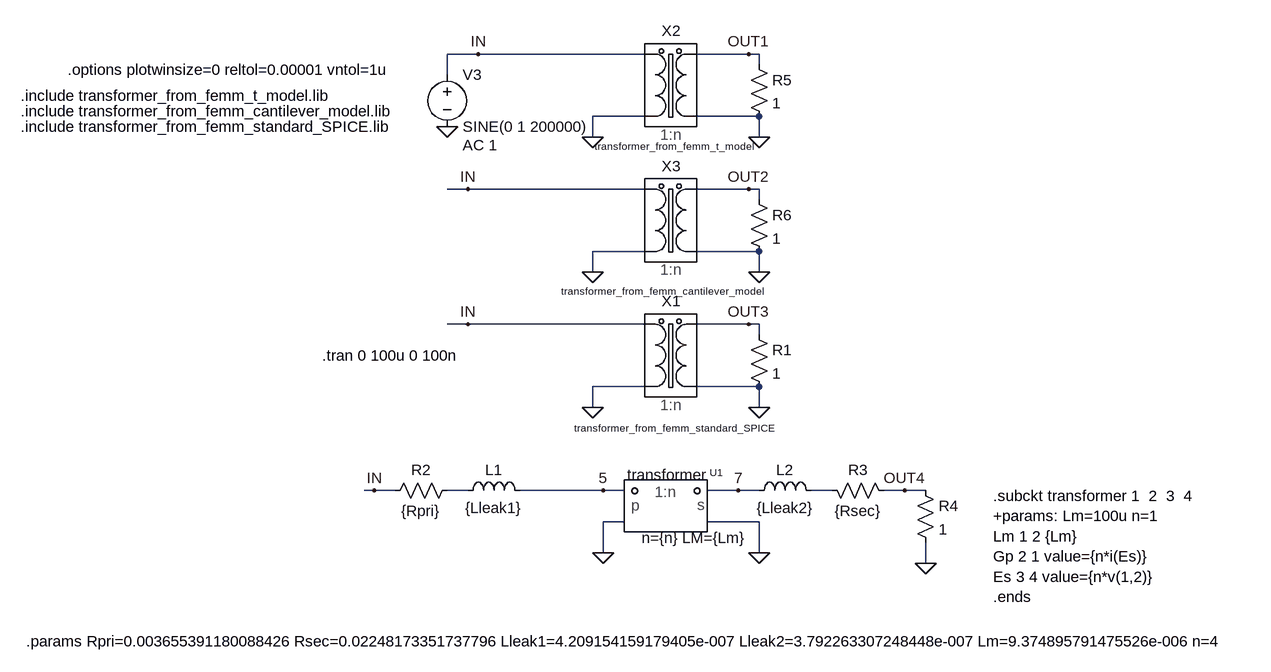
[diagram p0: schematic transformer_test.asc]
transformer_test.asc, the LTspice schematic file:
Version 4
SHEET 1 2508 680
WIRE -32 -256 -80 -256
WIRE 224 -256 -32 -256
WIRE 384 -256 304 -256
WIRE 400 -256 384 -256
WIRE 400 -240 400 -256
WIRE -80 -224 -80 -256
WIRE 224 -160 144 -160
WIRE 400 -160 304 -160
WIRE 144 -128 144 -160
WIRE 400 -128 400 -160
WIRE -48 -48 -80 -48
WIRE 224 -48 -48 -48
WIRE 384 -48 304 -48
WIRE 400 -48 384 -48
WIRE 400 -32 400 -48
WIRE 224 48 144 48
WIRE 400 48 304 48
WIRE 144 80 144 48
WIRE 400 80 400 48
WIRE -48 160 -80 160
WIRE 224 160 -48 160
WIRE 384 160 304 160
WIRE 400 160 384 160
WIRE 400 176 400 160
WIRE 224 256 144 256
WIRE 400 256 304 256
WIRE 144 288 144 256
WIRE 400 288 400 256
WIRE -192 416 -208 416
WIRE -160 416 -192 416
WIRE -48 416 -80 416
WIRE 160 416 32 416
WIRE 192 416 160 416
WIRE 368 416 320 416
WIRE 400 416 368 416
WIRE 512 416 480 416
WIRE 624 416 592 416
WIRE 656 416 624 416
WIRE 192 464 160 464
WIRE 400 464 320 464
WIRE 160 512 160 464
WIRE 400 512 400 464
WIRE 656 528 656 496
FLAG 160 416 5
FLAG 368 416 7
FLAG 160 512 0
FLAG 400 512 0
FLAG 656 528 0
FLAG -80 -144 0
FLAG 144 -128 0
FLAG 400 -128 0
FLAG -32 -256 IN
FLAG 384 -256 OUT1
FLAG -192 416 IN
FLAG 624 416 OUT4
FLAG 144 80 0
FLAG 400 80 0
FLAG 384 -48 OUT2
FLAG -48 -48 IN
FLAG 144 288 0
FLAG 400 288 0
FLAG 384 160 OUT3
FLAG -48 160 IN
SYMBOL res -64 400 R90
WINDOW 0 0 56 VBottom 2
WINDOW 3 32 56 VTop 2
SYMATTR InstName R2
SYMATTR Value {Rpri}
SYMBOL ind -64 432 R270
WINDOW 0 32 56 VTop 2
WINDOW 3 5 56 VBottom 2
SYMATTR InstName L1
SYMATTR Value {Lleak1}
SYMBOL res 496 400 M90
WINDOW 0 0 56 VBottom 2
WINDOW 3 32 56 VTop 2
SYMATTR InstName R3
SYMATTR Value {Rsec}
SYMBOL ind 496 432 M270
WINDOW 0 32 56 VTop 2
WINDOW 3 5 56 VBottom 2
SYMATTR InstName L2
SYMATTR Value {Lleak2}
SYMBOL transformer 256 448 R0
SYMATTR SpiceLine n={n} LM={Lm}
SYMATTR InstName U1
SYMBOL res 640 400 R0
SYMATTR InstName R4
SYMATTR Value 1
SYMBOL voltage -80 -240 R0
WINDOW 123 24 124 Left 2
WINDOW 39 0 0 Left 0
SYMATTR Value2 AC 1
SYMATTR InstName V3
SYMATTR Value SINE(0 1 200000)
SYMBOL res 384 -256 R0
SYMATTR InstName R5
SYMATTR Value 1
SYMBOL transformer_from_femm1 240 -208 R0
SYMATTR InstName X2
SYMATTR Value transformer_from_femm_t_model
SYMBOL res 384 -48 R0
SYMATTR InstName R6
SYMATTR Value 1
SYMBOL transformer_from_femm1 240 0 R0
WINDOW 3 8 109 Center 1
SYMATTR InstName X3
SYMATTR Value transformer_from_femm_cantilever_model
SYMBOL res 384 160 R0
SYMATTR InstName R1
SYMATTR Value 1
SYMBOL transformer_from_femm1 240 208 R0
WINDOW 3 27 112 Center 1
SYMATTR Value transformer_from_femm_standard_SPICE
SYMATTR InstName X1
TEXT -272 208 Left 2 !.tran 0 100u 0 100n
TEXT -728 648 Left 2 !.params Rpri=0.003655391180088426 Rsec=0.02248173351737796 Lleak1=4.209154159179405e-007 Lleak2=3.792263307248448e-007 Lm=9.374895791475526e-006 n=4
TEXT -664 -232 Left 2 !.options plotwinsize=0 reltol=0.00001 vntol=1u
TEXT -736 -168 Left 2 !.include transformer_from_femm_cantilever_model.lib
TEXT -736 -192 Left 2 !.include transformer_from_femm_t_model.lib
TEXT -736 -144 Left 2 !.include transformer_from_femm_standard_SPICE.lib
TEXT 760 424 Left 2 !.subckt transformer 1  2  3  4\n+params: Lm=100u n=1\nLm 1 2 {Lm}\nGp 2 1 value={n*i(Es)}\nEs 3 4 value={n*v(1,2)}\n.ends

The netlist it stands for:
* transformer_test.asc
R2 N001 IN {Rpri}
L1 N001 5 {Lleak1}
R3 N002 OUT4 {Rsec}
L2 N002 7 {Lleak2}
XU1 5 0 7 0 transformer n={n} LM={Lm}  ; pins 1 2 3 4
R4 OUT4 0 1
V3 IN 0 SINE(0 1 200000) AC 1
R5 OUT1 0 1
XX2 IN 0 OUT1 0 transformer_from_femm_t_model  ; pins 1 2 3 4
R6 OUT2 0 1
XX3 IN 0 OUT2 0 transformer_from_femm_cantilever_model  ; pins 1 2 3 4
R1 OUT3 0 1
XX1 IN 0 OUT3 0 transformer_from_femm_standard_SPICE  ; pins 1 2 3 4
.tran 0 100u 0 100n
.params Rpri=0.003655391180088426 Rsec=0.02248173351737796 Lleak1=4.209154159179405e-007 Lleak2=3.792263307248448e-007 Lm=9.374895791475526e-006 n=4
.options plotwinsize=0 reltol=0.00001 vntol=1u
.include transformer_from_femm_cantilever_model.lib
.include transformer_from_femm_t_model.lib
.include transformer_from_femm_standard_SPICE.lib
.subckt transformer 1  2  3  4
+params: Lm=100u n=1
Lm 1 2 {Lm}
Gp 2 1 value={n*i(Es)}
Es 3 4 value={n*v(1,2)}
.ends
.backanno
.end